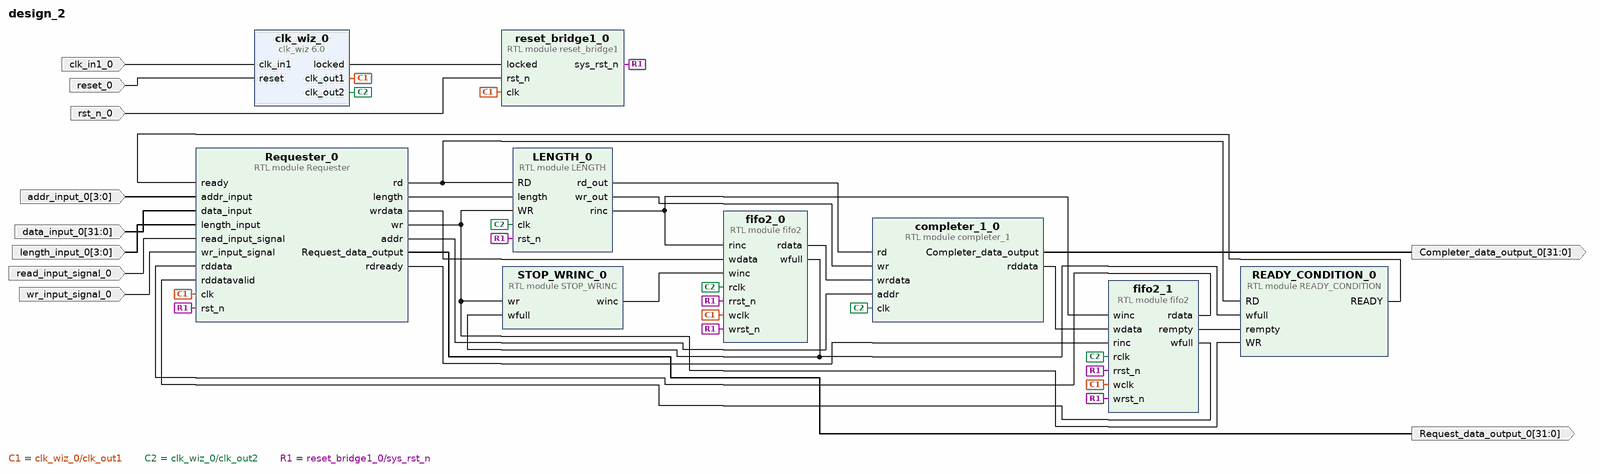
[diagram p0: block diagram of the top level]
# Vivado block design design_2, xc7a12ticsg325-1L, Vivado 2025.2
create_bd_design design_2

create_bd_port -dir O -from 31 -to 0 Request_data_output_0
create_bd_port -dir O -from 31 -to 0 Completer_data_output_0
create_bd_port -dir I -from 31 -to 0 data_input_0
create_bd_port -dir I -from 3 -to 0 length_input_0
create_bd_port -dir I -from 3 -to 0 addr_input_0
create_bd_port -dir I read_input_signal_0
create_bd_port -dir I wr_input_signal_0
create_bd_port -dir I -type rst reset_0
set_property -dict {CONFIG.POLARITY ACTIVE_HIGH} [get_bd_ports reset_0]
create_bd_port -dir I -type clk clk_in1_0
create_bd_port -dir I -type rst rst_n_0

create_bd_cell -type module -reference Requester Requester_0
create_bd_cell -type module -reference completer_1 completer_1_0
create_bd_cell -type module -reference LENGTH LENGTH_0
create_bd_cell -type module -reference fifo2 fifo2_0
create_bd_cell -type module -reference READY_CONDITION READY_CONDITION_0
create_bd_cell -type module -reference STOP_WRINC STOP_WRINC_0
create_bd_cell -type module -reference fifo2 fifo2_1
create_bd_cell -type ip -vlnv xilinx.com:ip:clk_wiz:6.0 clk_wiz_0
set_property -dict [list \
  CONFIG.CLKOUT1_JITTER 137.681 \
  CONFIG.CLKOUT1_PHASE_ERROR 105.461 \
  CONFIG.CLKOUT2_JITTER 140.709 \
  CONFIG.CLKOUT2_PHASE_ERROR 105.461 \
  CONFIG.CLKOUT2_REQUESTED_OUT_FREQ 90.000 \
  CONFIG.CLKOUT2_USED true \
  CONFIG.MMCM_CLKFBOUT_MULT_F 9.000 \
  CONFIG.MMCM_CLKOUT0_DIVIDE_F 9.000 \
  CONFIG.MMCM_CLKOUT1_DIVIDE 10 \
  CONFIG.NUM_OUT_CLKS 2 \
] [get_bd_cells clk_wiz_0]
create_bd_cell -type module -reference reset_bridge1 reset_bridge1_0

# ---- connections ----

connect_bd_net [get_bd_pins LENGTH_0/rd_out] [get_bd_pins completer_1_0/rd]
connect_bd_net [get_bd_pins LENGTH_0/rinc] [get_bd_pins fifo2_0/rinc] [get_bd_pins fifo2_1/winc]
connect_bd_net [get_bd_pins LENGTH_0/wr_out] [get_bd_pins completer_1_0/wr]
connect_bd_net [get_bd_pins READY_CONDITION_0/READY] [get_bd_pins Requester_0/ready]
connect_bd_net [get_bd_pins Requester_0/Request_data_output] [get_bd_ports Request_data_output_0]
connect_bd_net [get_bd_pins Requester_0/addr] [get_bd_pins completer_1_0/addr]
connect_bd_net [get_bd_pins Requester_0/length] [get_bd_pins LENGTH_0/length]
connect_bd_net [get_bd_pins Requester_0/rd] [get_bd_pins READY_CONDITION_0/RD] [get_bd_pins LENGTH_0/RD]
connect_bd_net [get_bd_pins Requester_0/rdready] [get_bd_pins fifo2_1/rinc]
connect_bd_net [get_bd_pins Requester_0/wr] [get_bd_pins STOP_WRINC_0/wr] [get_bd_pins READY_CONDITION_0/WR] [get_bd_pins LENGTH_0/WR]
connect_bd_net [get_bd_pins Requester_0/wrdata] [get_bd_pins fifo2_0/wdata]
connect_bd_net [get_bd_pins STOP_WRINC_0/winc] [get_bd_pins fifo2_0/winc]
connect_bd_net -net addr_input_0_1 [get_bd_ports addr_input_0] [get_bd_pins Requester_0/addr_input]
connect_bd_net -net clk_in1_0_1 [get_bd_ports clk_in1_0] [get_bd_pins clk_wiz_0/clk_in1]
connect_bd_net [get_bd_pins clk_wiz_0/clk_out1] \
  [get_bd_pins reset_bridge1_0/clk] [get_bd_pins Requester_0/clk] [get_bd_pins fifo2_0/wclk] [get_bd_pins fifo2_1/wclk]
connect_bd_net [get_bd_pins clk_wiz_0/clk_out2] \
  [get_bd_pins completer_1_0/clk] [get_bd_pins fifo2_0/rclk] [get_bd_pins fifo2_1/rclk] [get_bd_pins LENGTH_0/clk]
connect_bd_net [get_bd_pins clk_wiz_0/locked] [get_bd_pins reset_bridge1_0/locked]
connect_bd_net [get_bd_pins completer_1_0/Completer_data_output] [get_bd_ports Completer_data_output_0]
connect_bd_net [get_bd_pins completer_1_0/rddata] [get_bd_pins fifo2_1/wdata]
connect_bd_net -net data_input_0_1 [get_bd_ports data_input_0] [get_bd_pins Requester_0/data_input]
connect_bd_net [get_bd_pins fifo2_0/rdata] [get_bd_pins completer_1_0/wrdata]
connect_bd_net [get_bd_pins fifo2_0/wfull] [get_bd_pins STOP_WRINC_0/wfull] [get_bd_pins READY_CONDITION_0/wfull]
connect_bd_net [get_bd_pins fifo2_1/rdata] [get_bd_pins Requester_0/rddata]
connect_bd_net [get_bd_pins fifo2_1/rempty] [get_bd_pins READY_CONDITION_0/rempty]
connect_bd_net [get_bd_pins fifo2_1/wfull] [get_bd_pins Requester_0/rddatavalid]
connect_bd_net -net length_input_0_1 [get_bd_ports length_input_0] [get_bd_pins Requester_0/length_input]
connect_bd_net -net read_input_signal_0_1 [get_bd_ports read_input_signal_0] [get_bd_pins Requester_0/read_input_signal]
connect_bd_net -net reset_0_1 [get_bd_ports reset_0] [get_bd_pins clk_wiz_0/reset]
connect_bd_net [get_bd_pins reset_bridge1_0/sys_rst_n] \
  [get_bd_pins Requester_0/rst_n] [get_bd_pins fifo2_0/wrst_n] [get_bd_pins fifo2_0/rrst_n] [get_bd_pins fifo2_1/wrst_n] \
  [get_bd_pins fifo2_1/rrst_n] [get_bd_pins LENGTH_0/rst_n]
connect_bd_net -net rst_n_0_1 [get_bd_ports rst_n_0] [get_bd_pins reset_bridge1_0/rst_n]
connect_bd_net -net wr_input_signal_0_1 [get_bd_ports wr_input_signal_0] [get_bd_pins Requester_0/wr_input_signal]

validate_bd_design
save_bd_design
